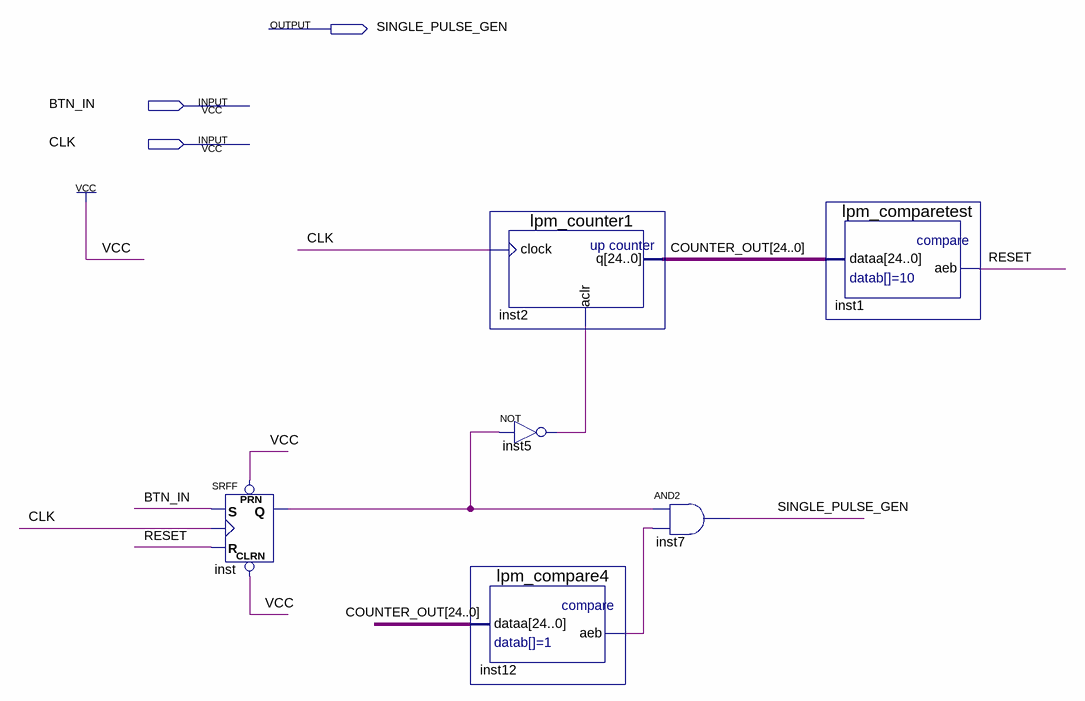
[diagram p0: schematic sheet]
// Quartus schematic g27_single_pulse_generator_test.bdf as structural Verilog: 6 symbols, 3 pins
module g27_single_pulse_generator_test (
  input  BTN_IN,
  input  CLK,
  output SINGLE_PULSE_GEN
);

  wire inst5_out, inst12_aeb, inst_q, RESET;
  wire [24:0] COUNTER_OUT;

  SRFF inst (.PRN(1'b1), .CLRN(1'b1), .S(BTN_IN), .R(RESET), .CLK(CLK), .Q(inst_q));
  lpm_counter1 inst2 (.clock(CLK), .aclr(inst5_out), .q(COUNTER_OUT));
  lpm_compare4 inst12 (.dataa(COUNTER_OUT), .aeb(inst12_aeb));
  not inst5 (inst5_out, inst_q);
  and inst7 (SINGLE_PULSE_GEN, inst_q, inst12_aeb);
  lpm_comparetest inst1 (.dataa(COUNTER_OUT), .aeb(RESET));
endmodule
